# Altium project TivaETH.PrjPCB
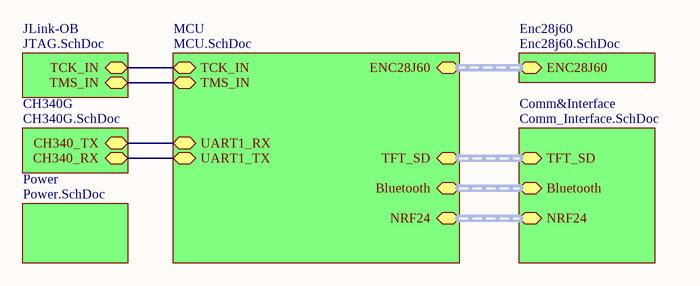
[diagram p0: TivaETH.SchDoc]
7 sheets, 149 parts. Net scope: hierarchical (ports join the sheet entries above them; power ports are global).
Sheets:
  TivaETH.SchDoc
    JLink-OB = JTAG.SchDoc
    MCU = MCU.SchDoc
    CH340G = CH340G.SchDoc
    Power = Power.SchDoc
    Enc28j60 = Enc28j60.SchDoc
    Comm&Interface = Comm_Interface.SchDoc

## Sheet TivaETH.SchDoc
size A4

### Sub-sheets
CH340G = CH340G.SchDoc: CH340_RX, CH340_TX
Comm&Interface = Comm_Interface.SchDoc: TFT_SD (harness TFT_SD), Bluetooth (harness Bluetooth), NRF24 (harness NRF24)
Enc28j60 = Enc28j60.SchDoc: ENC28J60 (harness Enc28j60)
JLink-OB = JTAG.SchDoc: TCK_IN, TMS_IN
MCU = MCU.SchDoc: TCK_IN, TMS_IN, UART1_RX, UART1_TX, ENC28J60 (harness Enc28j60), Bluetooth (harness Bluetooth), NRF24 (harness NRF24), TFT_SD (harness TFT_SD)
Power = Power.SchDoc: no entries

### Nets
TCK_IN: sheet JLink-OB/TCK_IN, sheet MCU/TCK_IN
TMS_IN: sheet JLink-OB/TMS_IN, sheet MCU/TMS_IN
UART1_RX: sheet MCU/UART1_RX, sheet CH340G/CH340_TX
UART1_TX: sheet MCU/UART1_TX, sheet CH340G/CH340_RX

### Buses and harness runs
harness sheet Comm&Interface/Bluetooth = sheet MCU/Bluetooth
harness sheet Comm&Interface/NRF24 = sheet MCU/NRF24
harness sheet Comm&Interface/TFT_SD = sheet MCU/TFT_SD
harness sheet Enc28j60/ENC28J60 = sheet MCU/ENC28J60

## Sheet JTAG.SchDoc
size A4
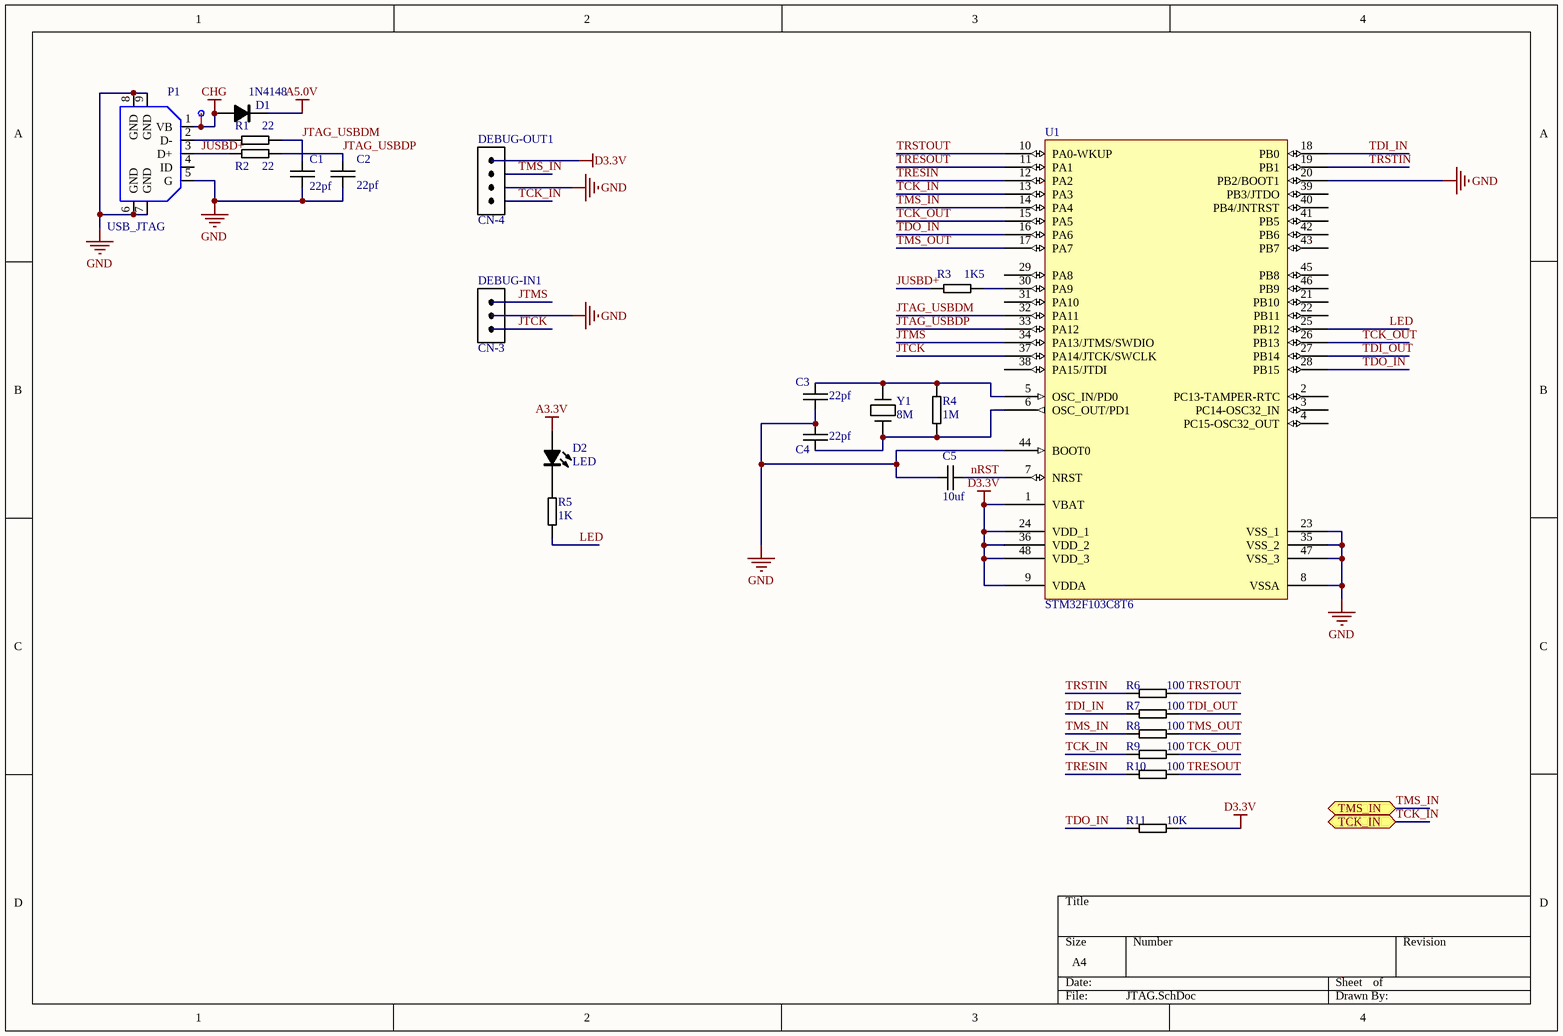
[diagram p1: JTAG.SchDoc]

### Parts
*1  Point  [Point]  (value not drawn)
C1  22pf  [0805-C]
C2  22pf  [0805-C]
C3  22pf  [0603]
C4  22pf  [0603]
C5  10uf  [0603]
D1  1N4148  [DO-35]
D2  LED  [0805-LED]
DEBUG-IN1  CN-3  [SIP-3]
DEBUG-OUT1  CN-4  [SIP-4]
P1  USB_JTAG  [USB_Mini_B]
R1  22  [0805-R]
R2  22  [0805-R]
R3  1K5  [0603]
R4  1M  [0603]
R5  1K  [0805-R]
R6  100  [0603]
R7  100  [0603]
R8  100  [0603]
R9  100  [0603]
R10  100  [0603]
R11  10K  [0603]
U1  STM32F103C8T6  [LQFP48_N]
Y1  8M  [XTAL(HC-49)]

### Ports
TCK_IN, TMS_IN

### Nets
A3.3V: D2.1(A)
A5.0V: D1.2(K)
CHG: *1.1(Point) D1.1(A) P1.1(VB)
D3.3V: DEBUG-OUT1.1 R11.2 U1.1(VBAT) U1.9(VDDA) U1.24(VDD_1) U1.36(VDD_2) U1.48(VDD_3)
GND: C1.2 C2.2 C3.2 C4.1 C5.1 DEBUG-IN1.2 DEBUG-OUT1.3 P1.5(G) P1.6(GND) P1.7(GND) P1.8(GND) P1.9(GND) U1.8(VSSA) U1.20(PB2/BOOT1) U1.23(VSS_1) U1.35(VSS_2) U1.44(BOOT0) U1.47(VSS_3)
JTAG_USBDM: C1.1 R1.2 U1.32(PA11)
JTAG_USBDP: C2.1 R2.2 U1.33(PA12)
JTCK: DEBUG-IN1.3 U1.37(PA14/JTCK/SWCLK)
JTMS: DEBUG-IN1.1 U1.34(PA13/JTMS/SWDIO)
JUSBD+: P1.3(D+) R2.1 R3.1
LED: R5.2 U1.25(PB12)
nRST: C5.2 U1.7(NRST)
TCK_IN: DEBUG-OUT1.4 R9.1 U1.13(PA3) ; port TCK_IN
TCK_OUT: R9.2 U1.15(PA5) U1.26(PB13)
TDI_IN: R7.1 U1.18(PB0)
TDI_OUT: R7.2 U1.27(PB14)
TDO_IN: R11.1 U1.16(PA6) U1.28(PB15)
TMS_IN: DEBUG-OUT1.2 R8.1 U1.14(PA4) ; port TMS_IN
TMS_OUT: R8.2 U1.17(PA7)
TRESIN: R10.1 U1.12(PA2)
TRESOUT: R10.2 U1.11(PA1)
TRSTIN: R6.1 U1.19(PB1)
TRSTOUT: R6.2 U1.10(PA0-WKUP)
NetC3_1: C3.1 R4.1 U1.5(OSC_IN/PD0) Y1.1
NetC4_2: C4.2 R4.2 U1.6(OSC_OUT/PD1) Y1.2
NetD2_2: D2.2(K) R5.1
NetP1_2: P1.2(D-) R1.1
NetR3_2: R3.2 U1.30(PA9)

Not connected (* = marked no-connect by the designer): P1 4(ID); U1 2(PC13-TAMPER-RTC) 3(PC14-OSC32_IN) 4(PC15-OSC32_OUT) 21(PB10) 22(PB11) 29(PA8) 31(PA10) 38(PA15/JTDI) 39(PB3/JTDO) 40(PB4/JNTRST) 41(PB5) 42(PB6) 43(PB7) 45(PB8) 46(PB9)

### Library data of the parts
C1-C5 = CAP_Chip: 贴片
D1 = 1N4148(DO-35): 1.04.08.0001
D2 = LED: 贴片
P1 = USB_Mini_B
R1-R11 = RES_Chip: 贴片
U1 = STM32F103C8T6: STM32 ARM-based 32-bit MCU with 64 Kbytes Flash, 48-pin LQFP, Industrial Temperature; Published: 30-May-2008; DatasheetVersion: rev6, Mar-2008; PackageVersion: Mar-2008; PackageReference: LQFP48; Publisher: Altium Limited; PackageDescription: 48-Pin Low-Profile Quad Flat Pack, 7 x 7 mm Body, 0.5 mm Pitch (LQFP48); ComponentLink1Description: Manufacturer Link; ComponentLink1URL: www.st.com/stm32; ComponentLink2Description: Datasheet; ComponentLink2URL: http://www.st.com/stonline/products/literature/ds/13587.pdf
Y1 = XTAL(12.000M,HC-49US): 1.07.02.0011

## Sheet MCU.SchDoc
size A3
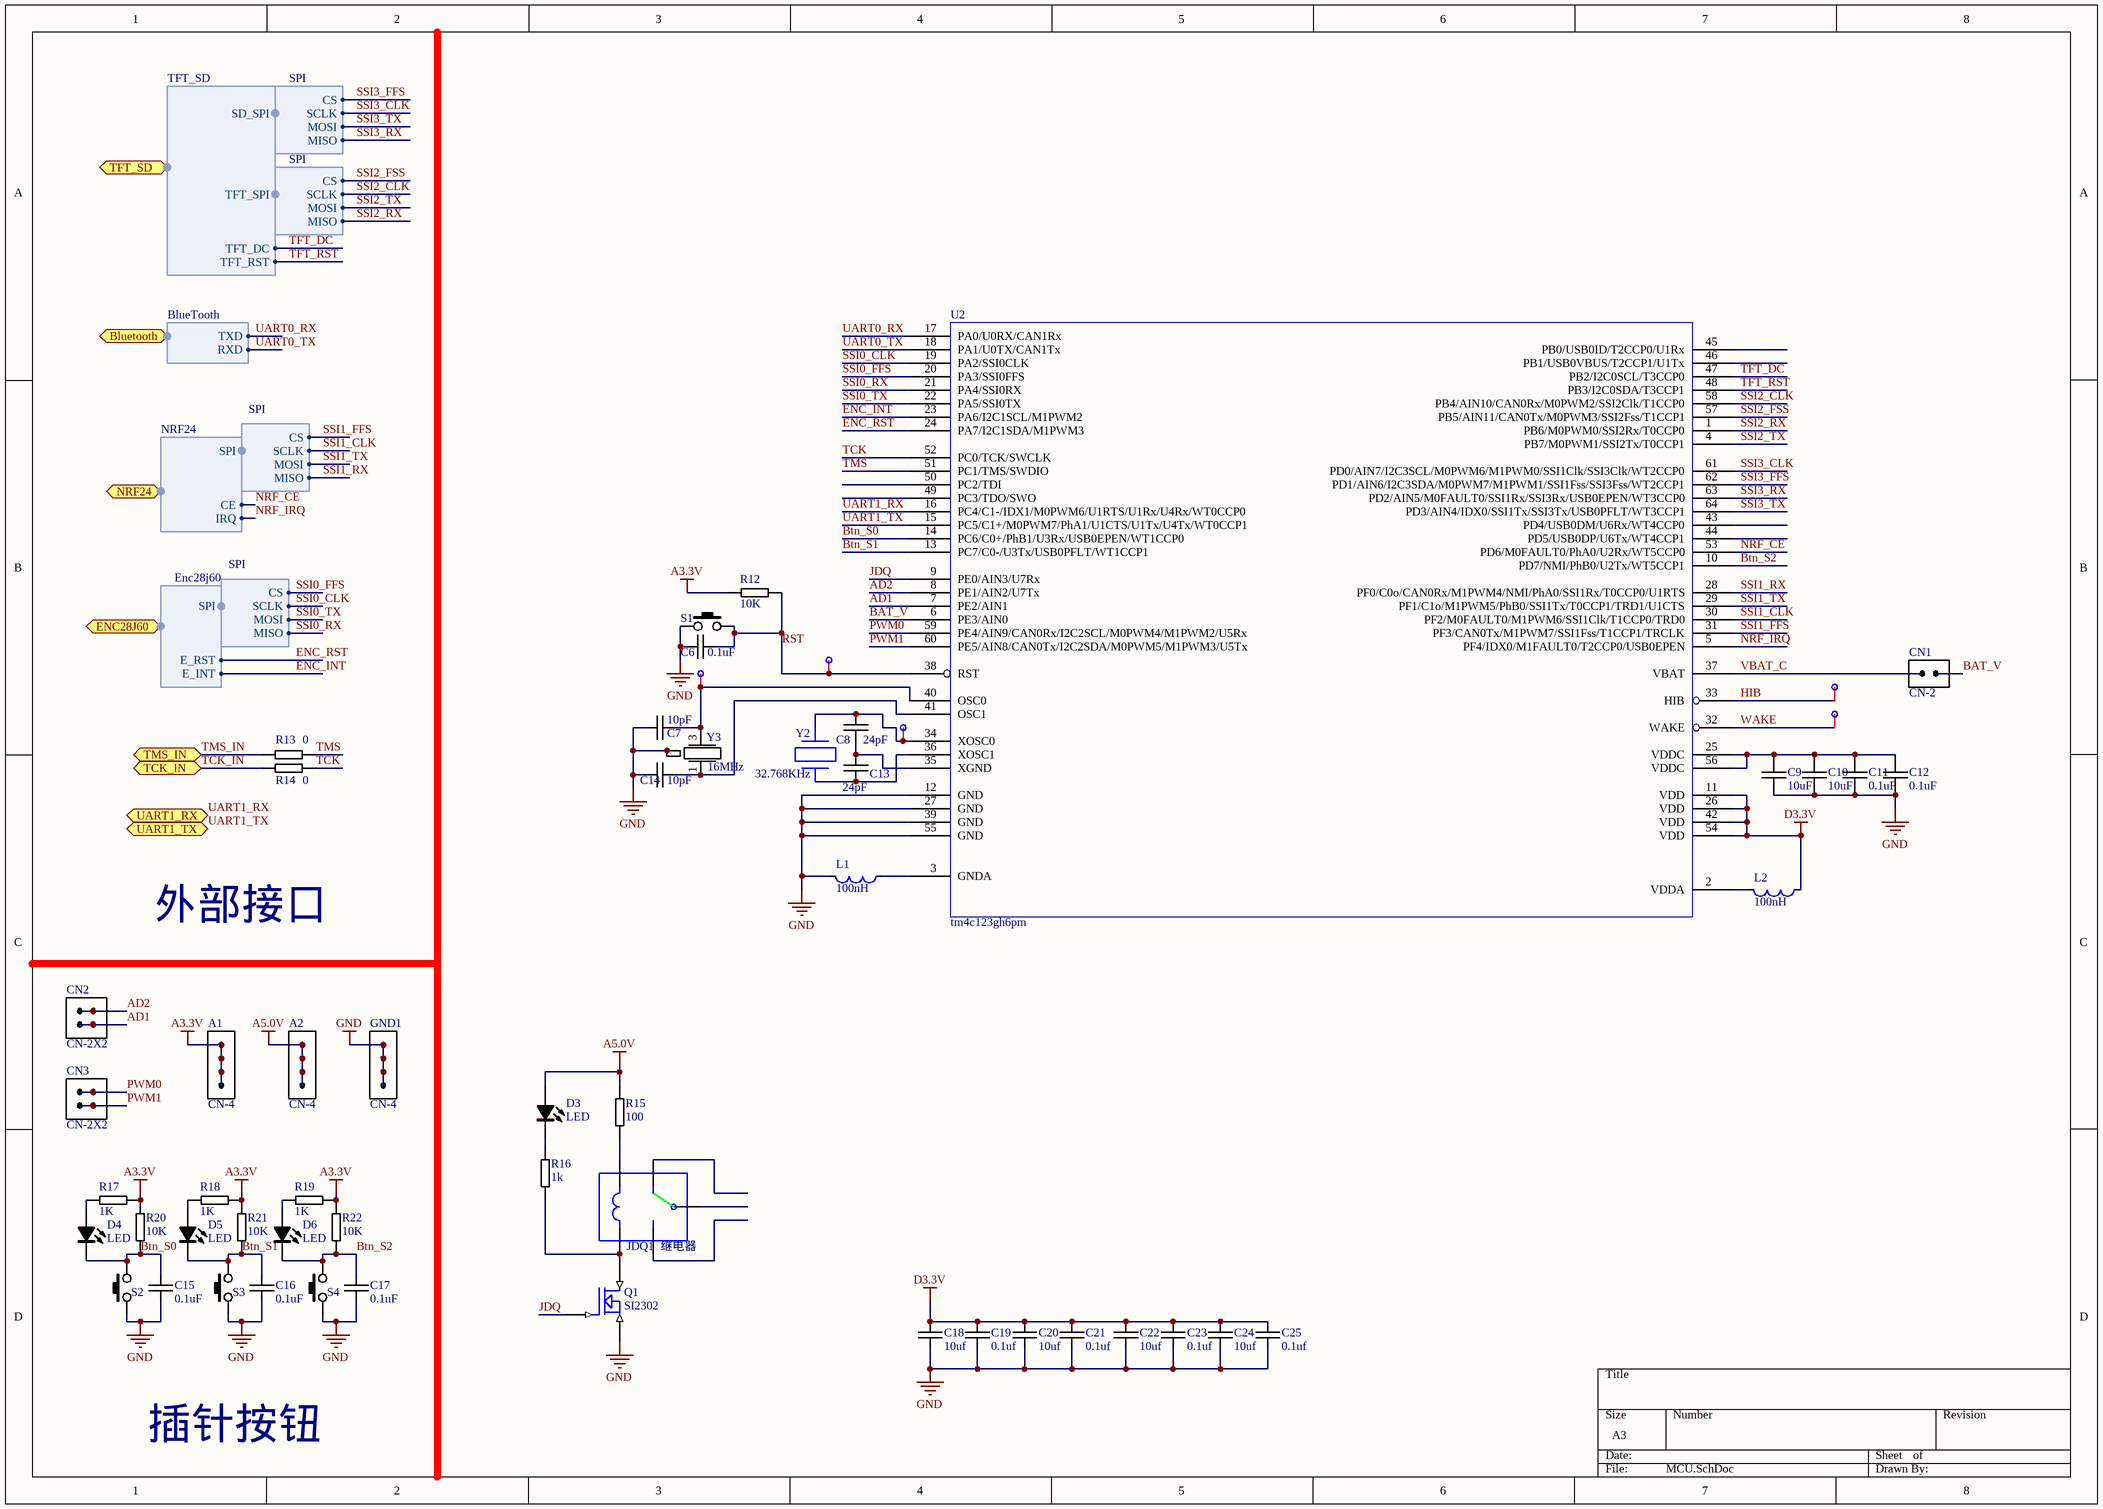
[diagram p2: MCU.SchDoc]

### Parts
A1  CN-4  [SIP-4]
A2  CN-4  [SIP-4]
C6  0.1uF  [0805-C]
C7  10pF  [0805-C]
C8  24pF  [0805-C]
C9  10uF  [0805-C]
C10  10uF  [0805-C]
C11  0.1uF  [0805-C]
C12  0.1uF  [0805-C]
C13  24pF  [0805-C]
C14  10pF  [0805-C]
C15  0.1uF  [0805-C]
C16  0.1uF  [0805-C]
C17  0.1uF  [0805-C]
C18  10uf  [0603]
C19  0.1uf  [0603]
C20  10uf  [0603]
C21  0.1uf  [0603]
C22  10uf  [0603]
C23  0.1uf  [0603]
C24  10uf  [0603]
C25  0.1uf  [0603]
CN1  CN-2  [SIP-2]
CN2  CN-2X2  [IDC-4]
CN3  CN-2X2  [IDC-4]
D3  LED  [0805-LED]
D4  LED  [0805-LED]
D5  LED  [0805-LED]
D6  LED  [0805-LED]
GND1  CN-4  [SIP-4]
JDQ1  继电器  [继电器]
L1  100nH  [0805]
L2  100nH  [0805]
P2  Point  [Point]  (value not drawn)
P3  Point  [Point]  (value not drawn)
P4  Point  [Point]  (value not drawn)
P5  Point  [Point]  (value not drawn)
P6  Point  [Point]  (value not drawn)
Q1  SI2302  [sot-23]
R12  10K  [0805-R]
R13  0  [0603]
R14  0  [0603]
R15  100  [0603]
R16  1k  [0805-R]
R17  1K  [0805-R]
R18  1K  [0805-R]
R19  1K  [0805-R]
R20  10K  [0805-R]
R21  10K  [0805-R]
R22  10K  [0805-R]
S1  KEY(轻触,6×6×4.3)  [轻触开关(3*6*2.5)]  (value not drawn)
S2  KEY(轻触,6×6×4.3)  [轻触开关(3*6*2.5)]  (value not drawn)
S3  KEY(轻触,6×6×4.3)  [轻触开关(3*6*2.5)]  (value not drawn)
S4  KEY(轻触,6×6×4.3)  [轻触开关(3*6*2.5)]  (value not drawn)
U2  tm4c123gh6pm  [LQFP64]
Y2  32.768KHz  [XTAL(Φ2×6)]
Y3  16MHz  [4脚晶振]

### Ports
Bluetooth (harness BlueTooth), ENC28J60 (harness Enc28j60), NRF24 (harness NRF24), TCK_IN, TFT_SD (harness TFT_SD), TMS_IN, UART1_RX, UART1_TX

### Harnesses
Enc28j60: SPI, E_RST, E_INT
SPI: CS, SCLK, MOSI, MISO
NRF24: SPI, CE, IRQ
BlueTooth: TXD, RXD
TFT_SD: SD_SPI, TFT_SPI, TFT_DC, TFT_RST

### Nets
A3.3V: A1.1 A1.2 A1.3 A1.4 R12.2 R17.2 R18.2 R19.2 R20.1 R21.1 R22.1
A5.0V: A2.1 A2.2 A2.3 A2.4 D3.1(A) R15.1
D3.3V: C18.1 C19.1 C20.1 C21.1 C22.1 C23.1 C24.1 C25.1 L2.2 U2.11(VDD) U2.26(VDD) U2.42(VDD) U2.54(VDD)
GND: C6.1 C7.1 C9.2 C10.2 C11.2 C12.2 C14.1 C15.1 C16.1 C17.1 C18.2 C19.2 C20.2 C21.2 C22.2 C23.2 C24.2 C25.2 GND1.1 GND1.2 GND1.3 GND1.4 L1.1 Q1.2(S) S1.1 S2.1 S3.1 S4.1 U2.12(GND) U2.27(GND) U2.39(GND) U2.55(GND) Y3.2(G) Y3.4(G)
AD1: CN2.3 CN2.4 U2.7(PE2/AIN1)
AD2: CN2.1 CN2.2 U2.8(PE1/AIN2/U7Tx)
BAT_V: CN1.2 U2.6(PE3/AIN0)
Btn_S0: C15.2 D4.2(K) R20.2 S2.2 U2.14(PC6/C0+/PhB1/U3Rx/USB0EPEN/WT1CCP0)
Btn_S1: C16.2 D5.2(K) R21.2 S3.2 U2.13(PC7/C0-/U3Tx/USB0PFLT/WT1CCP1)
Btn_S2: C17.2 D6.2(K) R22.2 S4.2 U2.10(PD7/NMI/PhB0/U2Tx/WT5CCP1)
ENC_INT: U2.23(PA6/I2C1SCL/M1PWM2) ; port ENC28J60.E_INT
ENC_RST: U2.24(PA7/I2C1SDA/M1PWM3) ; port ENC28J60.E_RST
HIB: P4.1(Point) U2.33(HIB)
JDQ: Q1.1(G) U2.9(PE0/AIN3/U7Rx)
NRF_CE: U2.53(PD6/M0FAULT0/PhA0/U2Rx/WT5CCP0) ; port NRF24.CE
NRF_IRQ: U2.5(PF4/IDX0/M1FAULT0/T2CCP0/USB0EPEN) ; port NRF24.IRQ
PWM0: CN3.1 CN3.2 U2.59(PE4/AIN9/CAN0Rx/I2C2SCL/M0PWM4/M1PWM2/U5Rx)
PWM1: CN3.3 CN3.4 U2.60(PE5/AIN8/CAN0Tx/I2C2SDA/M0PWM5/M1PWM3/U5Tx)
RST: C6.2 P2.1(Point) R12.1 S1.2 U2.38(RST)
SSI0_CLK: U2.19(PA2/SSI0CLK) ; harness SPI.SCLK  [project net ENC_SCK]
SSI0_FFS: U2.20(PA3/SSI0FFS) ; harness SPI.CS  [project net ENC_CS]
SSI0_RX: U2.21(PA4/SSI0RX) ; harness SPI.MISO  [project net ENC_MISO]
SSI0_TX: U2.22(PA5/SSI0TX) ; harness SPI.MOSI  [project net ENC_MOSI]
SSI1_CLK: U2.30(PF2/M0FAULT0/M1PWM6/SSI1Clk/T1CCP0/TRD0) ; harness SPI.SCLK  [project net NRF_SCK]
SSI1_FFS: U2.31(PF3/CAN0Tx/M1PWM7/SSI1Fss/T1CCP1/TRCLK) ; harness SPI.CS  [project net NRF_CSN]
SSI1_RX: U2.28(PF0/C0o/CAN0Rx/M1PWM4/NMI/PhA0/SSI1Rx/T0CCP0/U1RTS) ; harness SPI.MISO  [project net NRF_MISO]
SSI1_TX: U2.29(PF1/C1o/M1PWM5/PhB0/SSI1Tx/T0CCP1/TRD1/U1CTS) ; harness SPI.MOSI  [project net NRF_MOSI]
SSI2_CLK: U2.58(PB4/AIN10/CAN0Rx/M0PWM2/SSI2Clk/T1CCP0) ; harness SPI.SCLK
SSI2_FSS: U2.57(PB5/AIN11/CAN0Tx/M0PWM3/SSI2Fss/T1CCP1) ; harness SPI.CS
SSI2_RX: U2.1(PB6/M0PWM0/SSI2Rx/T0CCP0) ; harness SPI.MISO
SSI2_TX: U2.4(PB7/M0PWM1/SSI2Tx/T0CCP1) ; harness SPI.MOSI
SSI3_CLK: U2.61(PD0/AIN7/I2C3SCL/M0PWM6/M1PWM0/SSI1Clk/SSI3Clk/WT2CCP0) ; harness SPI.SCLK  [project net SD_SCK]
SSI3_FFS: U2.62(PD1/AIN6/I2C3SDA/M0PWM7/M1PWM1/SSI1Fss/SSI3Fss/WT2CCP1) ; harness SPI.CS  [project net SD_CS]
SSI3_RX: U2.63(PD2/AIN5/M0FAULT0/SSI1Rx/SSI3Rx/USB0EPEN/WT3CCP0) ; harness SPI.MISO  [project net SD_MISO]
SSI3_TX: U2.64(PD3/AIN4/IDX0/SSI1Tx/SSI3Tx/USB0PFLT/WT3CCP1) ; harness SPI.MOSI  [project net SD_MOSI]
TCK: R14.2 U2.52(PC0/TCK/SWCLK)
TCK_IN: R14.1 ; port TCK_IN
TFT_DC: U2.47(PB2/I2C0SCL/T3CCP0) ; port TFT_SD.TFT_DC
TFT_RST: U2.48(PB3/I2C0SDA/T3CCP1) ; port TFT_SD.TFT_RST
TMS: R13.2 U2.51(PC1/TMS/SWDIO)
TMS_IN: R13.1 ; port TMS_IN
UART0_RX: U2.17(PA0/U0RX/CAN1Rx) ; port Bluetooth.TXD  [project net Blu_RXD]
UART0_TX: U2.18(PA1/U0TX/CAN1Tx) ; port Bluetooth.RXD  [project net Blu_TXD]
UART1_RX: U2.16(PC4/C1-/IDX1/M0PWM6/U1RTS/U1Rx/U4Rx/WT0CCP0) ; port UART1_RX
UART1_TX: U2.15(PC5/C1+/M0PWM7/PhA1/U1CTS/U1Tx/U4Tx/WT0CCP1) ; port UART1_TX
VBAT_C: CN1.1 U2.37(VBAT)
WAKE: P5.1(Point) U2.32(WAKE)
NetC7_2: C7.2 P3.1(Point) U2.40(OSC0) Y3.3(O)
NetC8_1: C8.1 P6.1(Point) U2.34(XOSC0) Y2.1
NetC8_2: C8.2 C13.1 U2.35(XGND)
NetC9_1: C9.1 C10.1 C11.1 C12.1 U2.25(VDDC) U2.56(VDDC)
NetC13_2: C13.2 U2.36(XOSC1) Y2.2
NetC14_2: C14.2 U2.41(OSC1) Y3.1(O)
NetD3_2: D3.2(K) R16.1
NetD4_1: D4.1(A) R17.1
NetD5_1: D5.1(A) R18.1
NetD6_1: D6.1(A) R19.1
NetJDQ1_2: JDQ1.2(I1) R15.2
NetJDQ1_5: JDQ1.5(I2) Q1.3(D) R16.2
NetL1_2: L1.2 U2.3(GNDA)
NetL2_1: L2.1 U2.2(VDDA)

Not connected (* = marked no-connect by the designer): JDQ1 1 3(5) 4; U2 43(PD4/USB0DM/U6Rx/WT4CCP0) 44(PD5/USB0DP/U6Tx/WT4CCP1) 45(PB0/USB0ID/T2CCP0/U1Rx) 46(PB1/USB0VBUS/T2CCP1/U1Tx) 49(PC3/TDO/SWO) 50(PC2/TDI)

### Notes on the sheet
- 外部接口
- 插针按钮

### Library data of the parts
C6-C25 = CAP_Chip: 贴片
D3-D6 = LED: 贴片
L1 L2 = L
R12-R22 = RES_Chip: 贴片
S1-S4 = KEY(轻触,6×6×4.3): 1.09.02.0001
Y2 = XTAL_32_768
Y3 = XTAL_16M

## Sheet CH340G.SchDoc
size A4
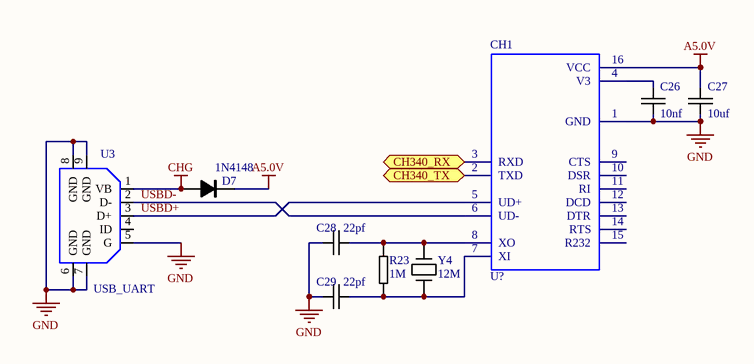
[diagram p3: CH340G.SchDoc]

### Parts
C26  10nf  [0603]
C27  10uf  [0603]
C28  22pf  [0603]
C29  22pf  [0603]
CH1  U?  [SOP-16(230)]
D7  1N4148  [DO-35]
R23  1M  [0603]
U3  USB_UART  [USB_Mini_B]
Y4  12M  [XTAL(HC-49)]

### Ports
CH340_RX, CH340_TX

### Nets
A5.0V: C27.1 CH1.16(VCC) D7.2(K)
CHG: D7.1(A) U3.1(VB)
GND: C26.2 C27.2 C28.1 C29.1 CH1.1(GND) U3.5(G) U3.6(GND) U3.7(GND) U3.8(GND) U3.9(GND)
UART1_RX: CH1.2(TXD) ; port CH340_TX
UART1_TX: CH1.3(RXD) ; port CH340_RX
USBD+: CH1.5(UD+) U3.3(D+)
USBD-: CH1.6(UD-) U3.2(D-)
NetC26_1: C26.1 CH1.4(V3)
NetC28_2: C28.2 CH1.8(XO) R23.1 Y4.1
NetC29_2: C29.2 CH1.7(XI) R23.2 Y4.2

Not connected (* = marked no-connect by the designer): CH1 9(CTS) 10(DSR) 11(RI) 12(DCD) 13(DTR) 14(RTS) 15(R232); U3 4(ID)

### Library data of the parts
C26-C29 = CAP_Chip: 贴片
CH1 = CH340G: USB-TTL芯片
D7 = 1N4148(DO-35): 1.04.08.0001
R23 = RES_Chip: 贴片
U3 = USB_Mini_B
Y4 = XTAL(12.000M,HC-49US): 1.07.02.0011

## Sheet Power.SchDoc
size A4
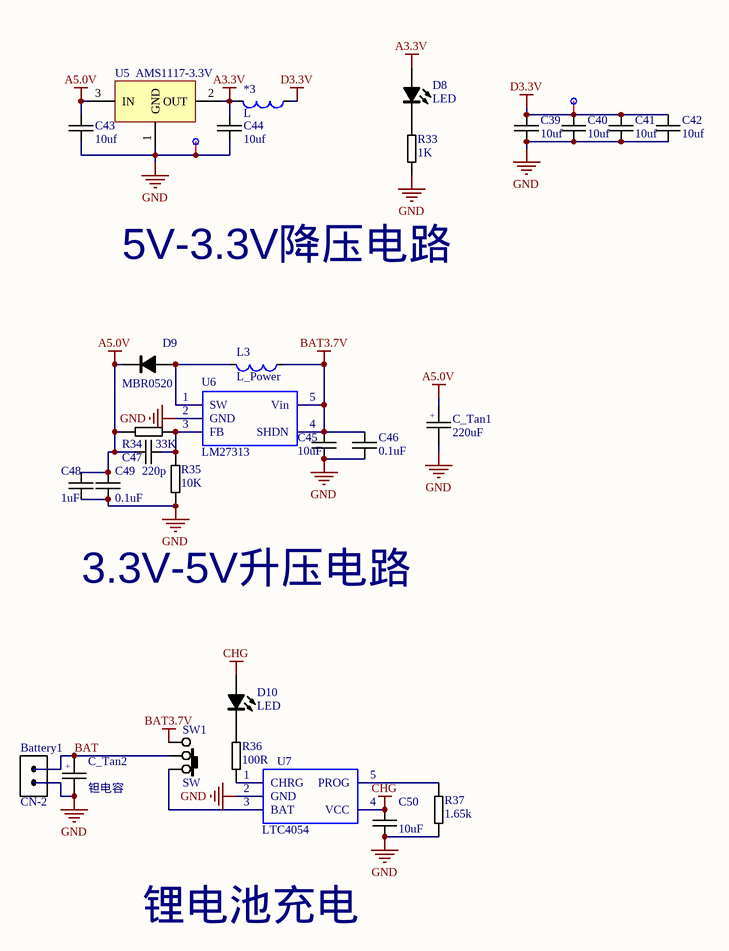
[diagram p4: Power.SchDoc]

### Parts
*3  L  [0603]
*4  Point  [Point]  (value not drawn)
*5  Point  [Point]  (value not drawn)
Battery1  CN-2  [SIP-2]
C39  10uf  [0805-C]
C40  10uf  [0805-C]
C41  10uf  [0805-C]
C42  10uf  [0805-C]
C43  10uf  [0805-C]
C44  10uf  [0805-C]
C45  10uF  [0603]
C46  0.1uF  [0603]
C47  220p  [0603]
C48  1uF  [0603]
C49  0.1uF  [0603]
C50  10uF  [0603]
C_Tan1  220uF  [钽电容7343]
C_Tan2  钽电容  [钽电容7343]
D8  LED  [0805-LED]
D9  MBR0520  [SOD-123-L]
D10  LED  [0603]
L3  L_Power  [GDSD3316]
R33  1K  [0805-R]
R34  33K  [0603]
R35  10K  [0603]
R36  100R  [0603]
R37  1.65k  [0603]
SW1  SW  [SW-SPDT(12.5×6,3)]
U5  AMS1117-3.3V  [SOT-223]
U6  LM27313  [DBV005_L]
U7  LTC4054  [DBV005_L]

### Nets
A3.3V: *3.1 C44.1 D8.1(A) U5.2(OUT)
A5.0V: C43.1 C47.1 C48.1 C49.1 C_Tan1.2 D9.2(K) R34.1 U5.3(IN)
BAT3.7V: C45.1 C46.1 L3.2 SW1.3 U6.4(SHDN) U6.5(Vin)
CHG: C50.1 D10.1(A) U7.4(VCC)
D3.3V: *3.2 *4.1(Point) C39.1 C40.1 C41.1 C42.1
GND: *5.1(Point) Battery1.2 C39.2 C40.2 C41.2 C42.2 C43.2 C44.2 C45.2 C46.2 C48.2 C49.2 C50.2 C_Tan1.1 C_Tan2.1 R33.2 R35.2 R37.2 U5.1(GND) U6.2(GND) U7.2(GND)
BAT: Battery1.1 C_Tan2.2 SW1.2
NetC47_2: C47.2 R34.2 R35.1 U6.3(FB)
NetD8_2: D8.2(K) R33.1
NetD9_1: D9.1(A) L3.1 U6.1(SW)
NetD10_2: D10.2(K) R36.1
NetR36_2: R36.2 U7.1(CHRG)
NetR37_1: R37.1 U7.5(PROG)
NetSW1_1: SW1.1 U7.3(BAT)

### Notes on the sheet
- 5V-3.3V降压电路
- 3.3V-5V升压电路
- 锂电池充电
- (in symbol 钽电容) +

### Library data of the parts
C39-C50 = CAP_Chip: 贴片
C_Tan1 = 钽电容
D8 D10 = LED: 贴片
D9 = MBR0520: 贴片
R33-R37 = RES_Chip: 贴片
SW1 = SW-SPDT(拨动开关,12.5×6×11): 1.09.07.0005
U5 = AMS1117

## Sheet Enc28j60.SchDoc
size A4
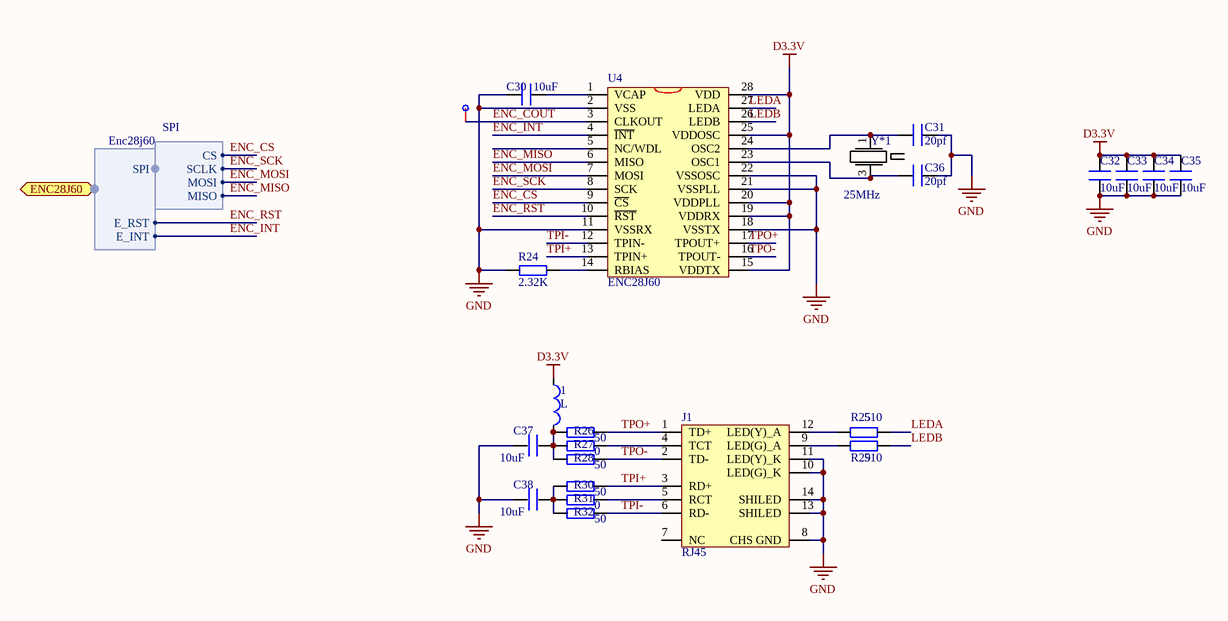
[diagram p5: Enc28j60.SchDoc]

### Parts
1  L  [0805]
*2  Point  [Point]  (value not drawn)
C30  10uF  [0805]
C31  20pf  [0603P]
C32  10uF  [0603P]
C33  10uF  [0603P]
C34  10uF  [0603P]
C35  10uF  [0603P]
C36  20pf  [0603P]
C37  10uF  [0603P]
C38  10uF  [0603P]
J1  RJ45  [HR911105A]
R24  2.32K  [0603P]
R25  510  [0603P]
R26  50  [0603P]
R27  0  [0603P]
R28  50  [0603P]
R29  510  [0603P]
R30  50  [0603P]
R31  0  [0603P]
R32  50  [0603P]
U4  ENC28J60  [SSOP28]
Y*1  25MHz  [4脚晶振]

### Ports
ENC28J60 (harness Enc28j60)

### Harnesses
Enc28j60: SPI, E_RST, E_INT
SPI: CS, SCLK, MOSI, MISO

### Nets
D3.3V: 1.2 C32.2 C33.2 C34.2 C35.2 U4.15(VDDTX) U4.19(VDDRX) U4.20(VDDPLL) U4.25(VDDOSC) U4.28(VDD)
GND: C30.1 C31.2 C32.1 C33.1 C34.1 C35.1 C36.2 C37.1 C38.1 J1.8(CHS_GND) J1.10(LED(G)_K) J1.11(LED(Y)_K) J1.13(SHILED) J1.14(SHILED) R24.1 U4.2(VSS) U4.11(VSSRX) U4.18(VSSTX) U4.21(VSSPLL) U4.22(VSSOSC)
ENC_COUT: *2.1(Point) U4.3(CLKOUT)
ENC_CS: U4.9(~{CS}) ; harness SPI.CS
ENC_INT: U4.4(~{INT}) ; port ENC28J60.E_INT
ENC_MISO: U4.6(MISO) ; harness SPI.MISO
ENC_MOSI: U4.7(MOSI) ; harness SPI.MOSI
ENC_RST: U4.10(~{RST}) ; port ENC28J60.E_RST
ENC_SCK: U4.8(SCK) ; harness SPI.SCLK
LEDA: R25.2 U4.27(LEDA)
LEDB: R29.2 U4.26(LEDB)
TPI+: J1.3(RD+) R30.2 U4.13(TPIN+)
TPI-: J1.6(RD-) R32.2 U4.12(TPIN-)
TPO+: J1.1(TD+) R26.2 U4.17(TPOUT+)
TPO-: J1.2(TD-) R28.2 U4.16(TPOUT-)
Net1_1: 1.1 C37.2 R26.1 R27.1 R28.1
NetC30_2: C30.2 U4.1(VCAP)
NetC31_1: C31.1 U4.24(OSC2) Y*1.1(O)
NetC36_1: C36.1 U4.23(OSC1) Y*1.3(O)
NetC38_2: C38.2 R30.1 R31.1 R32.1
NetJ1_4: J1.4(TCT) R27.2
NetJ1_5: J1.5(RCT) R31.2
NetJ1_9: J1.9(LED(G)_A) R29.1
NetJ1_12: J1.12(LED(Y)_A) R25.1
NetR24_2: R24.2 U4.14(RBIAS)

Not connected (* = marked no-connect by the designer): J1 7(NC); U4 5(NC/WDL); Y*1 2(G) 4(G)

### Library data of the parts
C30-C38 = C
J1 = HR911105
R24-R32 = R
Y*1 = XTAL_16M

## Sheet Comm_Interface.SchDoc
size A4
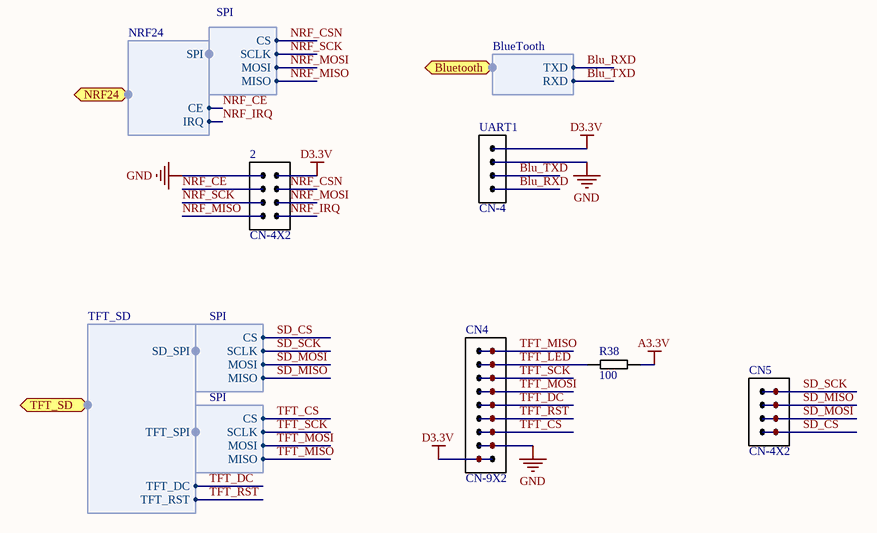
[diagram p6: Comm_Interface.SchDoc]

### Parts
2  CN-4X2  [IDC-8]
CN4  CN-9X2  [IDC-18]
CN5  CN-4X2  [IDC-8]
R38  100  [0805-R]
UART1  CN-4  [SIP-4]

### Ports
Bluetooth (harness BlueTooth), NRF24 (harness NRF24), TFT_SD (harness TFT_SD)

### Harnesses
NRF24: SPI, CE, IRQ
SPI: CS, SCLK, MOSI, MISO
BlueTooth: TXD, RXD
TFT_SD: SD_SPI, TFT_SPI, TFT_DC, TFT_RST

### Nets
A3.3V: R38.2
D3.3V: 2.2 CN4.17 CN4.18 UART1.1
GND: 2.1 CN4.15 CN4.16 UART1.2
Blu_RXD: UART1.4 ; port Bluetooth.TXD
Blu_TXD: UART1.3 ; port Bluetooth.RXD
NRF_CE: 2.3 ; port NRF24.CE
NRF_CSN: 2.4 ; harness SPI.CS
NRF_IRQ: 2.8 ; port NRF24.IRQ
NRF_MISO: 2.7 ; harness SPI.MISO
NRF_MOSI: 2.6 ; harness SPI.MOSI
NRF_SCK: 2.5 ; harness SPI.SCLK
SD_CS: CN5.7 CN5.8 ; harness SPI.CS
SD_MISO: CN5.3 CN5.4 ; harness SPI.MISO
SD_MOSI: CN5.5 CN5.6 ; harness SPI.MOSI
SD_SCK: CN5.1 CN5.2 ; harness SPI.SCLK
TFT_CS: CN4.13 CN4.14 ; harness SPI.CS  [project net SSI2_FSS]
TFT_DC: CN4.9 CN4.10 ; port TFT_SD.TFT_DC
TFT_LED: CN4.3 CN4.4 R38.1
TFT_MISO: CN4.1 CN4.2 ; harness SPI.MISO  [project net SSI2_RX]
TFT_MOSI: CN4.7 CN4.8 ; harness SPI.MOSI  [project net SSI2_TX]
TFT_RST: CN4.11 CN4.12 ; port TFT_SD.TFT_RST
TFT_SCK: CN4.5 CN4.6 ; harness SPI.SCLK  [project net SSI2_CLK]

### Library data of the parts
R38 = RES_Chip: 贴片

## Nets that join several sheets
A3.3V: JTAG (D2.1), MCU (11 pins), Power (*3.1 C44.1 D8.1 U5.2), Comm_Interface (R38.2)
A5.0V: JTAG (D1.2), MCU (6 pins), CH340G (C27.1 CH1.16 D7.2), Power (8 pins)
CHG: JTAG (*1.1 D1.1 P1.1), CH340G (D7.1 U3.1), Power (C50.1 D10.1 U7.4)
D3.3V: JTAG (7 pins), MCU (13 pins), Power (6 pins), Enc28j60 (10 pins), Comm_Interface (2.2 CN4.17 CN4.18 UART1.1)
GND: JTAG (18 pins), MCU (34 pins), CH340G (10 pins), Power (21 pins), Enc28j60 (20 pins), Comm_Interface (2.1 CN4.15 CN4.16 UART1.2)
Blu_RXD: MCU (U2.17), Comm_Interface (UART1.4)
Blu_TXD: MCU (U2.18), Comm_Interface (UART1.3)
ENC_CS: MCU (U2.20), Enc28j60 (U4.9)
ENC_INT: MCU (U2.23), Enc28j60 (U4.4)
ENC_MISO: MCU (U2.21), Enc28j60 (U4.6)
ENC_MOSI: MCU (U2.22), Enc28j60 (U4.7)
ENC_RST: MCU (U2.24), Enc28j60 (U4.10)
ENC_SCK: MCU (U2.19), Enc28j60 (U4.8)
NRF_CE: MCU (U2.53), Comm_Interface (2.3)
NRF_CSN: MCU (U2.31), Comm_Interface (2.4)
NRF_IRQ: MCU (U2.5), Comm_Interface (2.8)
NRF_MISO: MCU (U2.28), Comm_Interface (2.7)
NRF_MOSI: MCU (U2.29), Comm_Interface (2.6)
NRF_SCK: MCU (U2.30), Comm_Interface (2.5)
SD_CS: MCU (U2.62), Comm_Interface (CN5.7 CN5.8)
SD_MISO: MCU (U2.63), Comm_Interface (CN5.3 CN5.4)
SD_MOSI: MCU (U2.64), Comm_Interface (CN5.5 CN5.6)
SD_SCK: MCU (U2.61), Comm_Interface (CN5.1 CN5.2)
SSI2_CLK: MCU (U2.58), Comm_Interface (CN4.5 CN4.6)
SSI2_FSS: MCU (U2.57), Comm_Interface (CN4.13 CN4.14)
SSI2_RX: MCU (U2.1), Comm_Interface (CN4.1 CN4.2)
SSI2_TX: MCU (U2.4), Comm_Interface (CN4.7 CN4.8)
TCK_IN: JTAG (DEBUG-OUT1.4 R9.1 U1.13), MCU (R14.1)
TFT_DC: MCU (U2.47), Comm_Interface (CN4.9 CN4.10)
TFT_RST: MCU (U2.48), Comm_Interface (CN4.11 CN4.12)
TMS_IN: JTAG (DEBUG-OUT1.2 R8.1 U1.14), MCU (R13.1)
UART1_RX: MCU (U2.16), CH340G (CH1.2)
UART1_TX: MCU (U2.15), CH340G (CH1.3)